# Altium project UKU205V3.PRJPCB
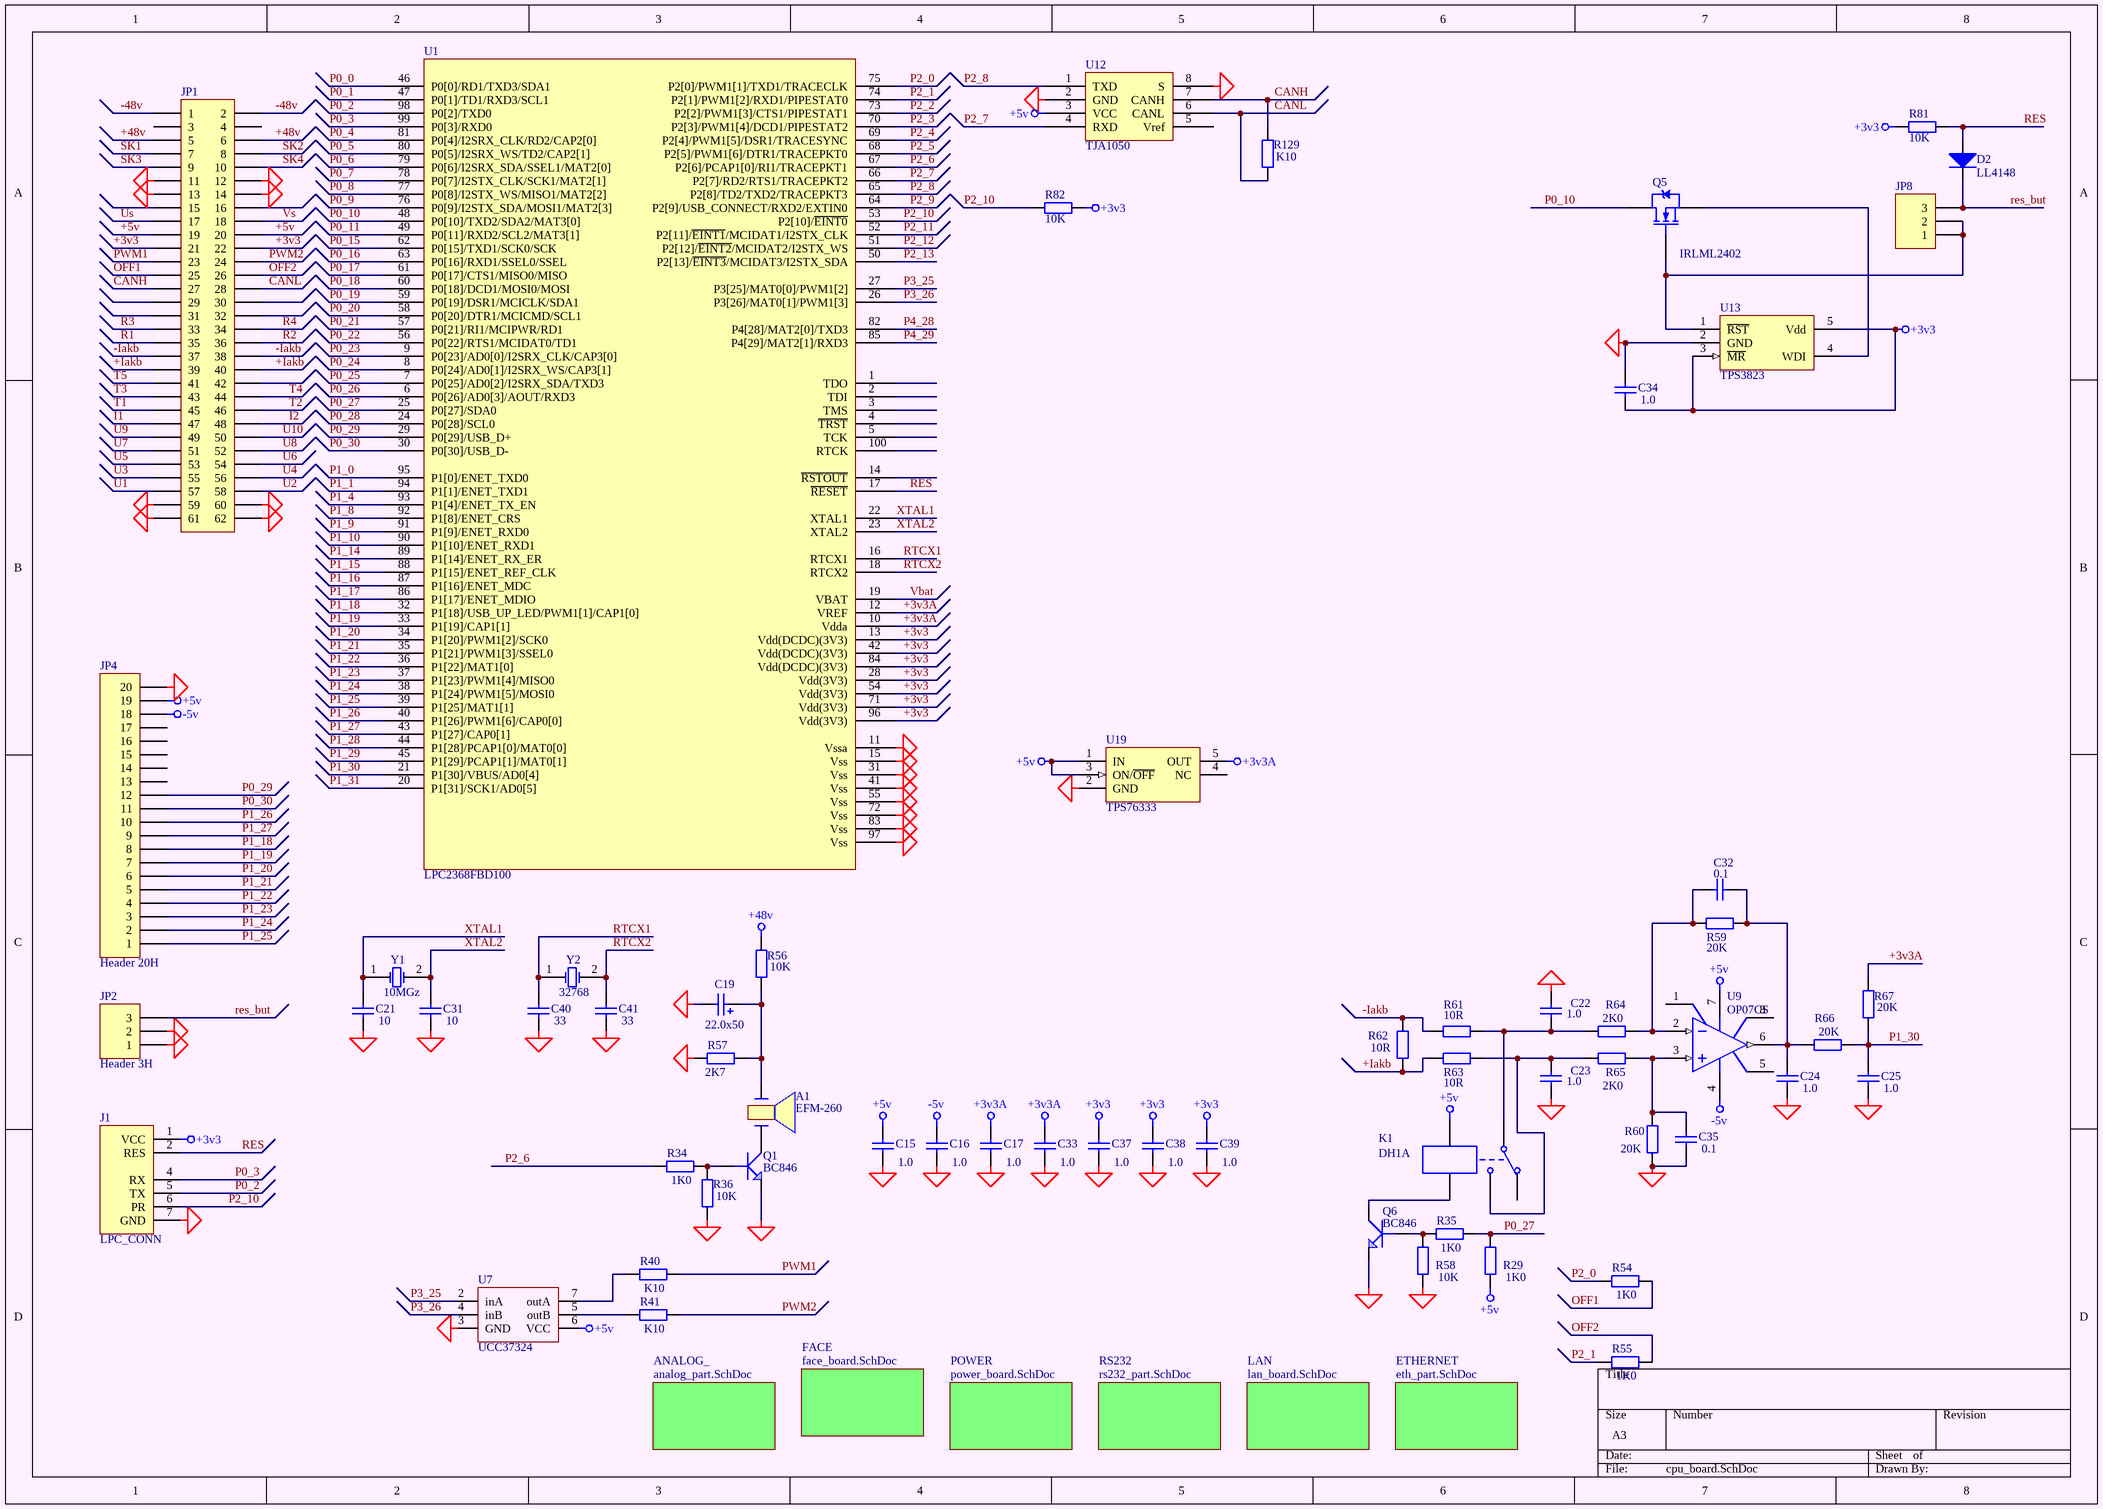
[diagram p0: cpu_board.SchDoc]
5 sheets, 258 parts. Net scope: flat (ports and power ports of the same name join across sheets).
Board file: UKU205V3.PcbDoc
Sheets:
  cpu_board.SchDoc
    POWER = power_board.SchDoc
    RS232 = rs232_part.SchDoc
    FACE = face_board.SchDoc
    ANALOG_ = analog_part.SchDoc

## Sheet cpu_board.SchDoc
size A3

### Parts
A1  EFM-260  [Pjezo15]
C15  1.0  [C3216-1206]
C16  1.0  [C3216-1206]
C17  1.0  [_1206]
C19  22.0x50  [el3]
C21  10  [_1206]
C22  1.0  [_1206]
C23  1.0  [_1206]
C24  1.0  [_1206]
C25  1.0  [_1206]
C31  10  [_1206]
C32  0.1  [_1206]
C33  1.0  [_1206]
C34  1.0  [_1206]
C35  0.1  [_1206]
C37  1.0  [_1206]
C38  1.0  [_1206]
C39  1.0  [_1206]
C40  33  [_1206]
C41  33  [_1206]
D2  LL4148  [_1206d]
J1  LPC_CONN  [HDR1X7]
JP1  (no value)  [HDR2X30]
JP2  Header 3H  [HDR1X3H]
JP4  Header 20H  [HDR1X20H]
JP8  PLS-3  [HDR1X3]  (value not drawn)
K1  DH1A  [kuan]
Q1  BC846  [SO-G3]
Q5  IRLML2402  [SO-G3]
Q6  BC846  [SO-G3]
R29  1K0  [_1206]
R34  1K0  [_1206]
R35  1K0  [_1206]
R36  10K  [_1206]
R40  K10  [_1206]
R41  K10  [_1206]
R54  1K0  [_1206]
R55  1K0  [_1206]
R56  10K  [_1206]
R57  2K7  [_1206]
R58  10K  [_1206]
R59  20K  [_1206]
R60  20K  [_1206]
R61  10R  [_1206]
R62  10R  [_1206]
R63  10R  [_1206]
R64  2K0  [_1206]
R65  2K0  [_1206]
R66  20K  [_1206]
R67  20K  [_1206]
R81  10K  [_1206]
R82  10K  [_1206]
R129  K10  [_1206]
U1  LPC2368FBD100  [LPC2368]
U7  UCC37324  [SO-G8]
U9  OP07CS  [SO-G8]
U12  TJA1050  [SO-G8]
U13  TPS3823  [SO-G5/P.95]
U19  TPS76333  [SO-G5/P.95]
Y1  10MGz  [QWARZ1]
Y2  32768  [QWARZ2]

### Sub-sheets
ANALOG_ = analog_part.SchDoc: no entries
ETHERNET = eth_part.SchDoc (file not in this document): no entries
FACE = face_board.SchDoc: no entries
LAN = lan_board.SchDoc (file not in this document): no entries
POWER = power_board.SchDoc: no entries
RS232 = rs232_part.SchDoc: no entries

### Nets
+3v3: C34.1 C37.2 C38.2 C39.2 J1.1(VCC) JP1.21 JP1.22 R81.2 R82.1 U1.13(Vdd(DCDC)(3V3)) U1.28(Vdd(3V3)) U1.42(Vdd(DCDC)(3V3)) U1.54(Vdd(3V3)) U1.71(Vdd(3V3)) U1.84(Vdd(DCDC)(3V3)) U1.96(Vdd(3V3)) U13.3(~{MR}) U13.5(Vdd)
+3v3A: C17.2 C33.2 R67.2 U1.10(Vdda) U1.12(VREF) U19.5(OUT)
+5v: C15.2 JP1.19 JP1.20 JP4.19 K1.4 R29.1 U7.6(VCC) U9.7(V+) U12.3(VCC) U19.1(IN) U19.3(ON/~{OFF})
+48v: JP1.5 JP1.6 R56.2
-5v: C16.2 JP4.18 U9.4(V-)
GND: C15.1 C16.1 C17.1 C19.2 C21.1 C22.1 C23.2 C24.1 C25.1 C31.1 C33.1 C34.2 C35.2 C37.1 C38.1 C39.1 C40.1 C41.1 J1.7(GND) JP1.11 JP1.12 JP1.13 JP1.14 JP1.59 JP1.60 JP1.61 JP1.62 JP2.1 JP2.2 JP4.20 Q1.2(E) Q6.2(E) R36.1 R57.1 R58.1 R60.1 U1.11(Vssa) U1.15(Vss) U1.31(Vss) U1.41(Vss) U1.55(Vss) U1.72(Vss) U1.83(Vss) U1.97(Vss) U7.3(GND) U12.2(GND) U12.8(S) U13.2(GND) U19.2(GND)
+Iakb: JP1.39 JP1.40 R62.1 R63.2
-48v: JP1.1 JP1.2
-Iakb: JP1.37 JP1.38 R61.2 R62.2
CANH: JP1.27 R129.2 U12.7(CANH)
CANL: JP1.28 R129.1 U12.6(CANL)
I1: JP1.47
I2: JP1.48
OFF1: JP1.25 R54.2
OFF2: JP1.26 R55.2
P0_0: U1.46(P0[0]/RD1/TXD3/SDA1)
P0_1: U1.47(P0[1]/TD1/RXD3/SCL1)
P0_2: J1.5(TX) U1.98(P0[2]/TXD0)
P0_3: J1.4(RX) U1.99(P0[3]/RXD0)
P0_4: U1.81(P0[4]/I2SRX_CLK/RD2/CAP2[0])
P0_5: U1.80(P0[5]/I2SRX_WS/TD2/CAP2[1])
P0_6: U1.79(P0[6]/I2SRX_SDA/SSEL1/MAT2[0])
P0_7: U1.78(P0[7]/I2STX_CLK/SCK1/MAT2[1])
P0_8: U1.77(P0[8]/I2STX_WS/MISO1/MAT2[2])
P0_9: U1.76(P0[9]/I2STX_SDA/MOSI1/MAT2[3])
P0_10: Q5.3(D) U1.48(P0[10]/TXD2/SDA2/MAT3[0])
P0_11: U1.49(P0[11]/RXD2/SCL2/MAT3[1])
P0_15: U1.62(P0[15]/TXD1/SCK0/SCK)
P0_16: U1.63(P0[16]/RXD1/SSEL0/SSEL)
P0_17: U1.61(P0[17]/CTS1/MISO0/MISO)
P0_18: U1.60(P0[18]/DCD1/MOSI0/MOSI)
P0_19: U1.59(P0[19]/DSR1/MCICLK/SDA1)
P0_20: U1.58(P0[20]/DTR1/MCICMD/SCL1)
P0_21: U1.57(P0[21]/RI1/MCIPWR/RD1)
P0_22: U1.56(P0[22]/RTS1/MCIDAT0/TD1)
P0_23: U1.9(P0[23]/AD0[0]/I2SRX_CLK/CAP3[0])
P0_24: U1.8(P0[24]/AD0[1]/I2SRX_WS/CAP3[1])
P0_25: U1.7(P0[25]/AD0[2]/I2SRX_SDA/TXD3)
P0_26: U1.6(P0[26]/AD0[3]/AOUT/RXD3)
P0_27: R29.2 R35.1 U1.25(P0[27]/SDA0)
P0_28: U1.24(P0[28]/SCL0)
P0_29: JP4.12 U1.29(P0[29]/USB_D+)
P0_30: JP4.11 U1.30(P0[30]/USB_D-)
P1_0: U1.95(P1[0]/ENET_TXD0)
P1_1: U1.94(P1[1]/ENET_TXD1)
P1_4: U1.93(P1[4]/ENET_TX_EN)
P1_8: U1.92(P1[8]/ENET_CRS)
P1_9: U1.91(P1[9]/ENET_RXD0)
P1_10: U1.90(P1[10]/ENET_RXD1)
P1_14: U1.89(P1[14]/ENET_RX_ER)
P1_15: U1.88(P1[15]/ENET_REF_CLK)
P1_16: U1.87(P1[16]/ENET_MDC)
P1_17: U1.86(P1[17]/ENET_MDIO)
P1_18: JP4.8 U1.32(P1[18]/USB_UP_LED/PWM1[1]/CAP1[0])
P1_19: JP4.7 U1.33(P1[19]/CAP1[1])
P1_20: JP4.6 U1.34(P1[20]/PWM1[2]/SCK0)
P1_21: JP4.5 U1.35(P1[21]/PWM1[3]/SSEL0)
P1_22: JP4.4 U1.36(P1[22]/MAT1[0])
P1_23: JP4.3 U1.37(P1[23]/PWM1[4]/MISO0)
P1_24: JP4.2 U1.38(P1[24]/PWM1[5]/MOSI0)
P1_25: JP4.1 U1.39(P1[25]/MAT1[1])
P1_26: JP4.10 U1.40(P1[26]/PWM1[6]/CAP0[0])
P1_27: JP4.9 U1.43(P1[27]/CAP0[1])
P1_28: U1.44(P1[28]/PCAP1[0]/MAT0[0])
P1_29: U1.45(P1[29]/PCAP1[1]/MAT0[1])
P1_30: C25.2 R66.2 R67.1 U1.21(P1[30]/VBUS/AD0[4])
P1_31: U1.20(P1[31]/SCK1/AD0[5])
P2_0: R54.1 U1.75(P2[0]/PWM1[1]/TXD1/TRACECLK)
P2_1: R55.1 U1.74(P2[1]/PWM1[2]/RXD1/PIPESTAT0)
P2_2: U1.73(P2[2]/PWM1[3]/CTS1/PIPESTAT1)
P2_3: U1.70(P2[3]/PWM1[4]/DCD1/PIPESTAT2)
P2_4: U1.69(P2[4]/PWM1[5]/DSR1/TRACESYNC)
P2_5: U1.68(P2[5]/PWM1[6]/DTR1/TRACEPKT0)
P2_6: R34.1 U1.67(P2[6]/PCAP1[0]/RI1/TRACEPKT1)
P2_7: U1.66(P2[7]/RD2/RTS1/TRACEPKT2) U12.4(RXD)
P2_8: U1.65(P2[8]/TD2/TXD2/TRACEPKT3) U12.1(TXD)
P2_9: U1.64(P2[9]/USB_CONNECT/RXD2/EXTIN0)
P2_10: J1.6(PR) R82.2 U1.53(P2[10]/~{EINT0})
P2_11: U1.52(P2[11]/~{EINT1}/MCIDAT1/I2STX_CLK)
P2_12: U1.51(P2[12]/~{EINT2}/MCIDAT2/I2STX_WS)
P2_13: U1.50(P2[13]/~{EINT3}/MCIDAT3/I2STX_SDA)
P3_25: U1.27(P3[25]/MAT0[0]/PWM1[2]) U7.2(inA)
P3_26: U1.26(P3[26]/MAT0[1]/PWM1[3]) U7.4(inB)
P4_28: U1.82(P4[28]/MAT2[0]/TXD3)
P4_29: U1.85(P4[29]/MAT2[1]/RXD3)
PWM1: JP1.23 R40.1
PWM2: JP1.24 R41.1
R1: JP1.35
R2: JP1.36
R3: JP1.33
R4: JP1.34
RES: D2.1(A) J1.2(RES) R81.1 U1.17(~{RESET})
res_but: D2.2(K) JP2.3 JP8.3
RTCX1: C40.2 U1.16(RTCX1) Y2.1(OSC1)
RTCX2: C41.2 U1.18(RTCX2) Y2.2(OSC2)
SK1: JP1.7
SK2: JP1.8
SK3: JP1.9
SK4: JP1.10
T1: JP1.45
T2: JP1.46
T3: JP1.43
T4: JP1.44
T5: JP1.41
U1: JP1.57
U2: JP1.58
U3: JP1.55
U4: JP1.56
U5: JP1.53
U6: JP1.54
U7: JP1.51
U8: JP1.52
U9: JP1.49
U10: JP1.50
Us: JP1.17
Vbat: U1.19(VBAT)
Vs: JP1.18
XTAL1: C21.2 U1.22(XTAL1) Y1.1(OSC1)
XTAL2: C31.2 U1.23(XTAL2) Y1.2(OSC2)
NetA1_1: A1.1 Q1.3(C)
NetA1_2: A1.2 C19.1 R56.1 R57.2
NetC22_2: C22.2 K1.1 R61.1 R64.1
NetC23_1: C23.1 K1.3 R63.1 R65.1
NetC24_2: C24.2 C32.2 R59.1 R66.1 U9.6(OUT)
NetC32_1: C32.1 R59.2 R64.2 U9.2(IN-)
NetC35_1: C35.1 R60.2 R65.2 U9.3(IN+)
NetJP8_1: JP8.1 JP8.2 Q5.1(G) U13.1(~{RST})
NetK1_5: K1.5 Q6.3(C)
NetQ1_1: Q1.1(B) R34.2 R36.2
NetQ5_2: Q5.2(S) U13.4(WDI)
NetQ6_1: Q6.1(B) R35.2 R58.2
NetR40_2: R40.2 U7.7(outA)
NetR41_2: R41.2 U7.5(outB)

Not connected (* = marked no-connect by the designer): JP1 3 4 15 16 29 30 31 32 42; JP4 13 14 15 16 17; K1 2; U1 1(TDO) 2(TDI) 3(TMS) 4(~{TRST}) 5(TCK) 14(~{RSTOUT}) 100(RTCK); U9 1(VOSTRIM) 5(NC) 8(VOSTRIM); U12 5(Vref); U19 4(NC)

### Library data of the parts
A1 = PJEZ0
C15-C17 C32 C33 C35 C37-C39 = Cap Semi: Capacitor (Semiconductor SIM Model); Manufacturer: Generic Components; Class I: Passive; Value: 0,1; Published: 8-Jun-2000; Revision: July-2002: Re-released for DXP Platform.; Publisher: Altium Limited; Class II: Capacitor
C19 = Cap Pol1: Polarized Capacitor (Radial); Manufacturer: Generic Components; Class I: Passive; Value: 22,0; Published: 8-Jun-2000; Revision: July-2002: Re-released for DXP Platform.; Publisher: Altium Limited; Class II: Capacitor
C21 C31 C40 C41 = Cap Semi: Capacitor (Semiconductor SIM Model); Manufacturer: Generic Components; Class I: Passive; Value: 15pF; Published: 8-Jun-2000; Revision: July-2002: Re-released for DXP Platform.; Publisher: Altium Limited; Class II: Capacitor
C22-C25 = Cap Semi: Capacitor (Semiconductor SIM Model); Manufacturer: Generic Components; Class I: Passive; Value: 1,0; Published: 8-Jun-2000; Revision: July-2002: Re-released for DXP Platform.; Publisher: Altium Limited; Class II: Capacitor
C34 = Cap Semi: Capacitor; Manufacturer: Generic Components; Class I: Passive; Value: 0,1; Published: 8-Jun-2000; Revision: July-2002: Re-released for DXP Platform.; Publisher: Altium Limited; Class II: Capacitor
D2 = Diode: Default Diode; Manufacturer: Generic Components; Class I: Discrete; Class II: Diode - Switching; Published: 8-Jun-2000; Revision: July-2002: Re-released for DXP Platform.; Publisher: Altium Limited
JP1 = Header 31X2: Header, 30-Pin, Dual row; Manufacturer: Generic Components; Class I: Connector; Revision: July-2002: Re-released for DXP Platform.; Publisher: Altium Limited
JP2 = Header 3H: Header, 3-Pin,  Right Angle; Manufacturer: Generic Components; Class I: Connector; Revision: July-2002: Re-released for DXP Platform.; Publisher: Altium Limited
JP4 = Header 20H: Header, 20-Pin,  Right Angle; Manufacturer: Generic Components; Class I: Connector; Revision: July-2002: Re-released for DXP Platform.; Publisher: Altium Limited
JP8 = Header 3: Header, 3-Pin; Manufacturer: Generic Components; Class I: Connector; Revision: July-2002: Re-released for DXP Platform.; Publisher: Altium Limited
K1 = BS115: Single-Pole Dual-Throw Relay; Manufacturer: Generic Components; Class I: Electro-mechanical; Published: 24-Mar-1999; Revision: July-2002: Re-released for DXP Platform.; Publisher: Altium Limited; Class II: Relay
Q1 Q6 = GT122: Right: 20; Bottom: 20
Q5 = IRLML2402: HEXFET Power MOSFET; Manufacturer: International Rectifier; Class I: Discrete; Class II: MOSFET - Power; Published: 8-Jun-2000; Revision: July-2002: Re-released for DXP Platform.; Datasheet: Latest Revision: Aug-1997; Package Reference: SOT-23; Publisher: Altium Limited; Value: IRLML2402
R29 = Res2: Resistor; Manufacturer: Generic Components; Class I: Passive; Value: 10K; Published: 8-Jun-2000; Revision: July-2002: Re-released for DXP Platform.; Publisher: Altium Limited; Class II: Resistor
R34 R35 R40 R41 R54-R57 R61-R63 R81 R82 = Res2: Resistor; Manufacturer: Generic Components; Class I: Passive; Rule: Undefined; Published: 8-Jun-2000; Revision: July-2002: Re-released for DXP Platform.; Publisher: Altium Limited; Class II: Resistor
  R34 R35 R54 R55: Value: 1K0
  R40 R41: Value: K10
  R56 R81 R82: Value: 10K
  R57: Value: 2K7
  R61-R63: Value: 10R
R36 R58-R60 R64-R67 = Res2: Resistor; Manufacturer: Generic Components; Class I: Passive; Published: 8-Jun-2000; Revision: July-2002: Re-released for DXP Platform.; Publisher: Altium Limited; Class II: Resistor
  R36 R58: Value: 10K
  R59 R60 R66 R67: Value: 20K
  R64 R65: Value: 2K0
R129 = Res2: Resistor; Manufacturer: Generic Components; Class I: Passive; Value: 120; Published: 8-Jun-2000; Revision: July-2002: Re-released for DXP Platform.; Publisher: Altium Limited; Class II: Resistor
U9 = OP07CS: Ultra-Low Offset Voltage Operational Amplifier; Manufacturer: Analog Devices; Note: Pin 5 is not connected.; Published: 8-Jun-2000; Revision: July-2002: Re-released for DXP Platform.; Datasheet: Designer's Reference Manual CD (1992); Package Reference: SO-8B; Publisher: Altium Limited; Class I: Amplifier; Class II: Operational Amplifier
U13 = TPS3823: Reset IC; Manufacturer: National Semiconductor; Package Information: Latest Revision: Aug-1999; Class I: Power Management; Class II: Voltage Regulator; Value: TPS76333; Published: 15-Apr-2002; Datasheet: Latest Revision: Oct-1999; Package Reference: MA05B; Publisher: Altium Limited
U19 = LP2980AIM5-3.3: Micropower SOT, 50 mA Ultra Low-Dropout Regulator; Manufacturer: National Semiconductor; Package Information: Latest Revision: Aug-1999; Class I: Power Management; Class II: Voltage Regulator; Published: 15-Apr-2002; Datasheet: Latest Revision: Oct-1999; Package Reference: MA05B; Publisher: Altium Limited
Y1 Y2 = XTAL: Crystal Oscillator; Manufacturer: Generic Components; Published: 8-Jun-2000; Revision: July-2002: Re-released for DXP Platform.; Publisher: Altium Limited; Class I: Oscillator; Class II: Crystal Oscillator

## Sheet power_board.SchDoc
size A3
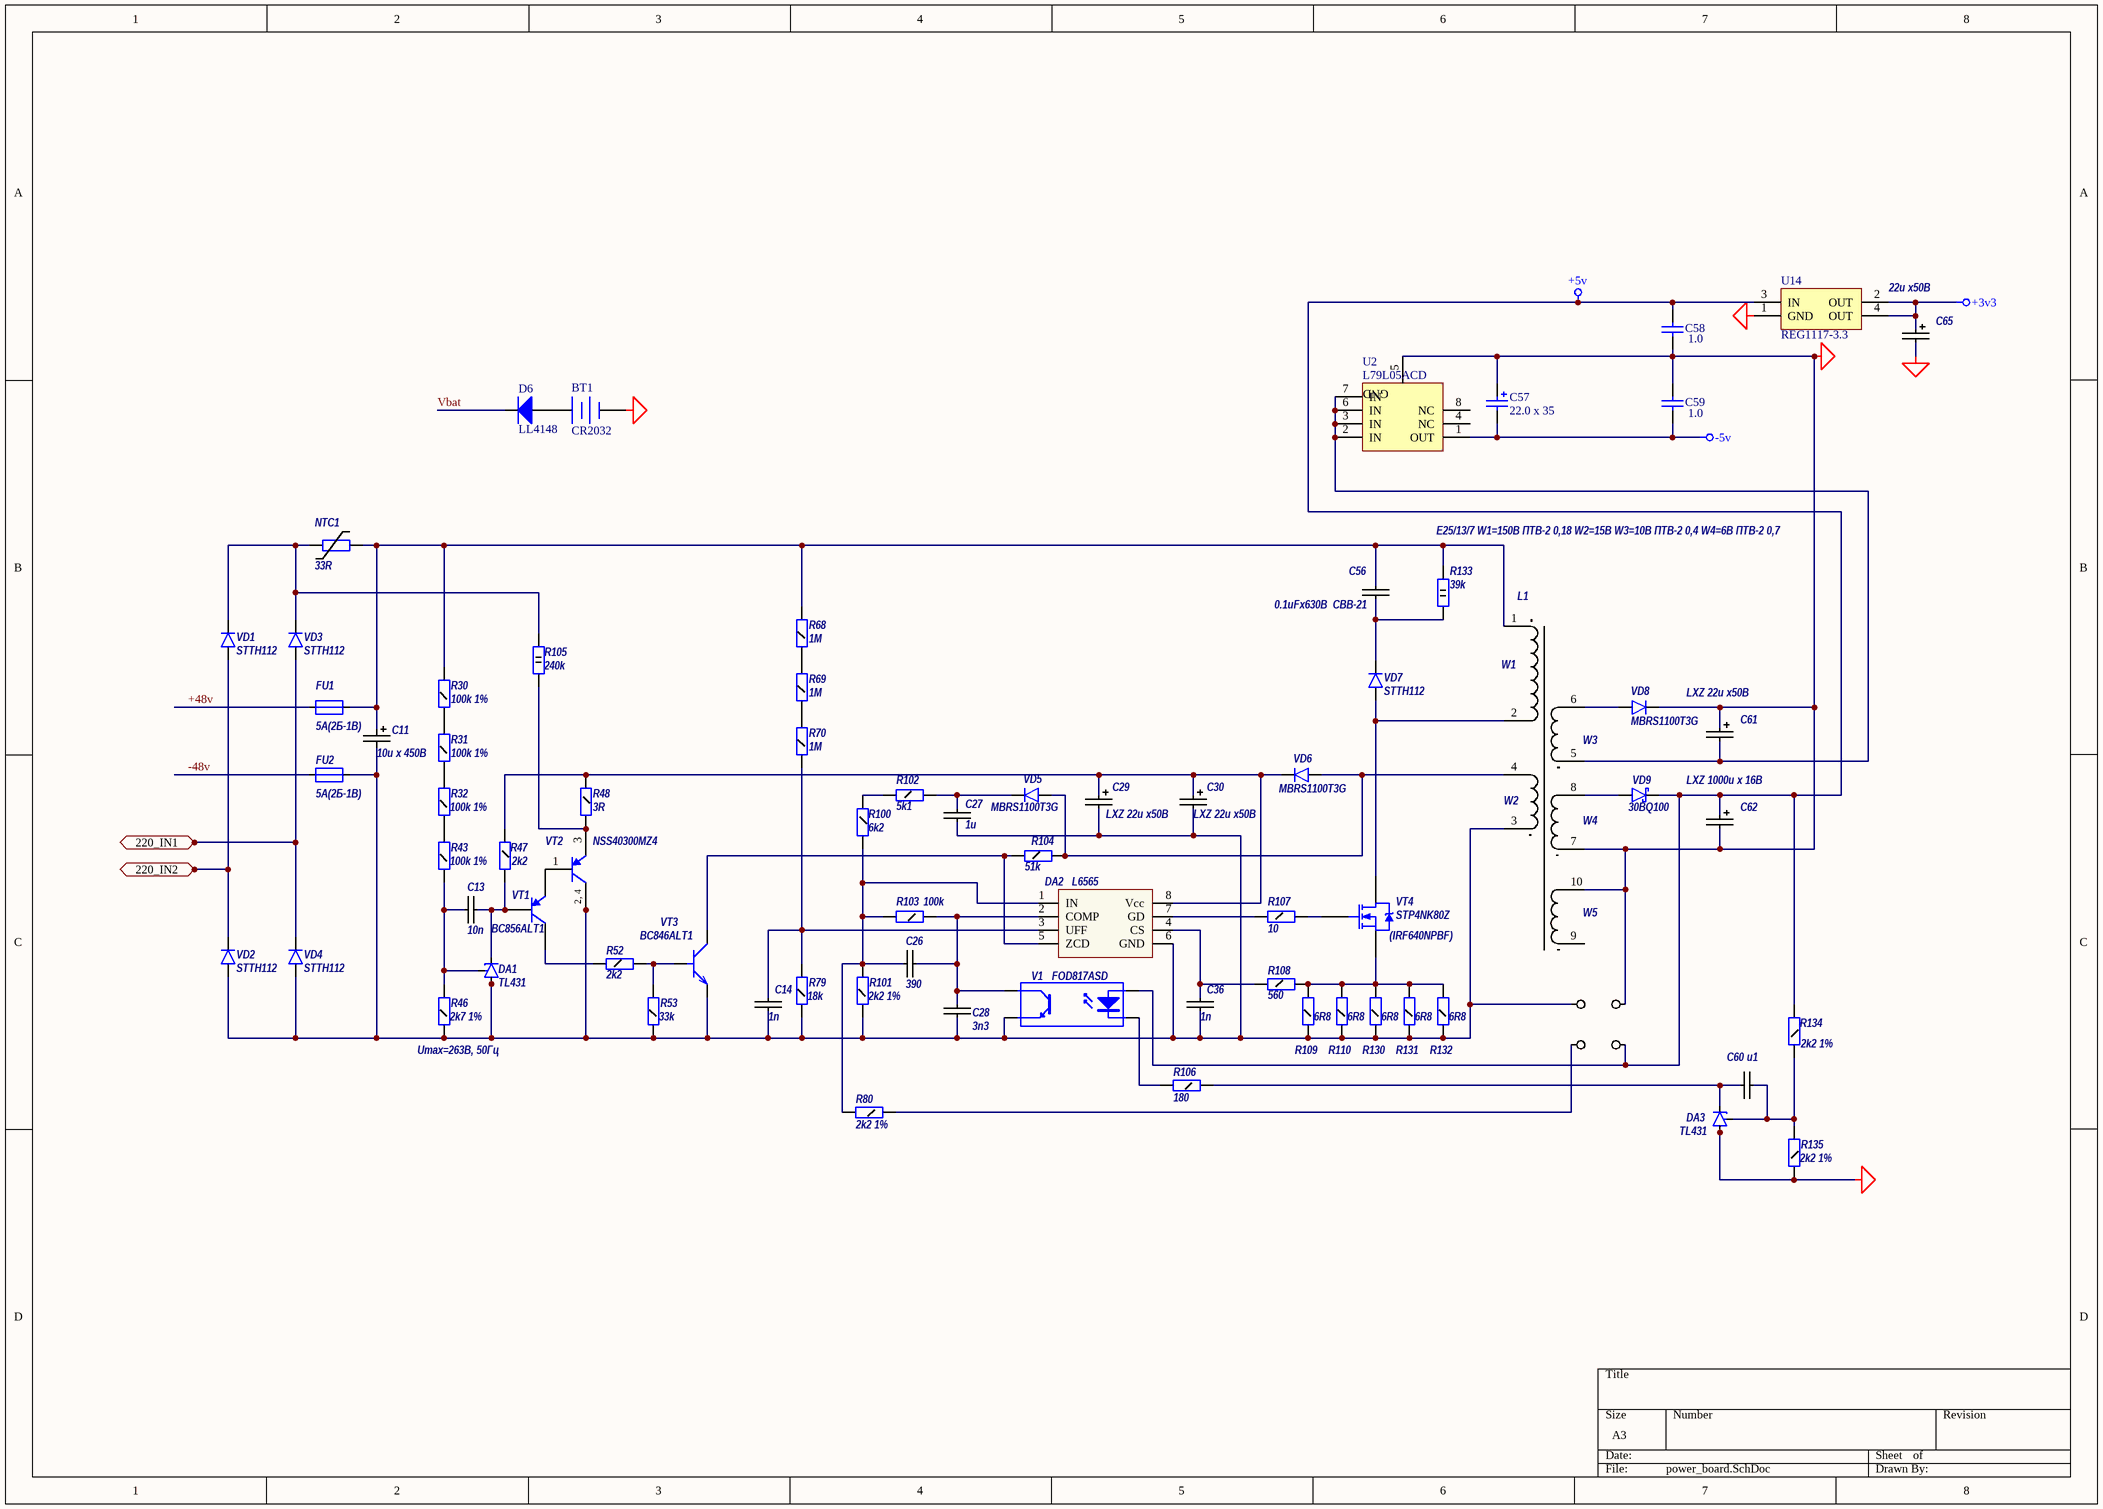
[diagram p1: power_board.SchDoc]

### Parts
BT1  CR2032  [BAT_SUPP]
C11  10u x 450B  [10uf x 450V]
C13  10n  [_1206]
C14  1n  [_1206]
C26  390  [_1206]
C27  1u  [_1206]
C28  3n3  [_1206]
C29  LXZ 22u x50B  [CAP_POL_6.3x12]
C30  LXZ 22u x50B  [CAP_POL_6.3x12]
C36  1n  [_1206]
C56  0.1uFx630B  CBB-21  [0.1uf *630V]
C57  22.0 x 35  [el3]
C58  1.0  [C3216-1206]
C59  1.0  [C3216-1206]
C60  u1  [_1206]
C61  LXZ 22u x50B  [CAP_POL_6.3x12]
C62  LXZ 1000u x 16B  [CAP_POL_13x21]
C65  22u x50B  [CAP_POL_6.3x12]
D6  LL4148  [_1206d]
DA1  TL431  [SO-G8]
DA2  L6565  [SO-G8]
DA3  TL431  [SO-G8]
FU1  5A(2Б-1В)  [FUSE-3A]
FU2  5A(2Б-1В)  [FUSE-3A]
L1  E25/13/7 W1=150B ПТВ-2 0,18 W2=15B W3=10B ПТВ-2 0,4 W4=6B ПТВ-2 0,7  [Lps_360RH]
NTC1  33R  [NTC 33R]
R30  100k 1%  [_1206]
R31  100k 1%  [_1206]
R32  100k 1%  [_1206]
R43  100k 1%  [_1206]
R46  2k7 1%  [_1206]
R47  2k2  [_1206]
R48  3R  [_1206]
R52  2k2  [_1206]
R53  33k  [_1206]
R68  1M  [_1206]
R69  1M  [_1206]
R70  1M  [_1206]
R79  18k  [_1206]
R80  2k2 1%  [_1206]
R100  6k2  [_1206]
R101  2k2 1%  [_1206]
R102  5k1  [_1206]
R103  100k  [_1206]
R104  51k  [_1206]
R105  240k  [MF-2 vert]
R106  180  [_1206]
R107  10  [_1206]
R108  560  [_1206]
R109  6R8  [_1206]
R110  6R8  [_1206]
R130  6R8  [_1206]
R131  6R8  [_1206]
R132  6R8  [_1206]
R133  39k  [MF-2 vert]
R134  2k2 1%  [_1206]
R135  2k2 1%  [_1206]
U2  L79L05ACD  [SO-G8]
U14  REG1117-3.3  [SIP-G3/C7.4]
V1  FOD817ASD  [FOD817ASD]
VD1  STTH112  [10bq*]
VD2  STTH112  [10bq*]
VD3  STTH112  [10bq*]
VD4  STTH112  [10bq*]
VD5  MBRS1100T3G  [10bq*]
VD6  MBRS1100T3G  [10bq*]
VD7  STTH112  [10bq*]
VD8  MBRS1100T3G  [10bq*]
VD9  30BQ100  [30bq*]
VT1  BC856ALT1  [318-08]
VT2  NSS40300MZ4  [SOT223_N]
VT3  BC846ALT1  [SOT-23]
VT4  STP4NK80Z  [TO-220AB]
XP1  PAD  [PAD_otv]  (value not drawn)
XP2  PAD  [PAD_otv]  (value not drawn)
XP3  PAD  [PAD_otv]  (value not drawn)
XP4  PAD  [PAD_otv]  (value not drawn)
XP5  PAD  [PAD_otv]  (value not drawn)
XP6  PAD  [PAD_otv]  (value not drawn)

### Ports
220_IN1, 220_IN2

### Nets
+3v3: C65.+ U14.2(OUT) U14.4(OUT)
+5v: C58.2 C62.+ R134.2 U14.3(IN) V1.1(A) VD9.2 XP6.1
-5v: C57.2 C59.1 U2.1(OUT)
GND: BT1.2(-) C57.1 C58.1 C59.2 C61.+ C62.- C65.- DA3.6 DA3.7 L1.7 L1.10 R135.1 U2.5(GND) U14.1(GND) VD8.2 XP5.1
+48v: FU1.1
-48v: FU2.1
Vbat: D6.2(K)
NetBT1_1: BT1.1(+) D6.1(A)
NetC11_1: C11.1 C56.1(OA) FU1.2 L1.1 NTC1.2 R30.2 R68.2 R133.2
NetC11_2: C11.2 C14.2(OA) C27.2(OA) C28.1(OA) C29.- C30.- C36.2(OA) DA1.6 DA1.7 DA2.6(GND) FU2.2 L1.3 R46.1 R53.1 R79.1 R101.1 R109.1 R110.1 R130.1 R131.1 R132.1 V1.3(E) VD2.1 VD4.1 VT2.2(C) VT2.4(C) VT3.2 XP3.1
NetC13_1: C13.1(OA) DA1.8 R43.1 R46.2
NetC13_2: C13.2(OA) DA1.1 R47.2 VT1.1(B)
NetC14_1: C14.1(OA) DA2.3(UFF) R70.1 R79.2
NetC26_1: C26.1(OA) DA2.1(IN) R80.2 R100.2 R101.2 R103.2
NetC26_2: C26.2(OA) C28.2(OA) DA2.2(COMP) R103.1 V1.4(C)
NetC27_1: C27.1(OA) R102.2 VD5.2
NetC29_+: C29.+ C30.+ DA2.8(Vcc) R47.1 R48.1 VD6.2
NetC36_1: C36.1(OA) DA2.4(CS) R108.1
NetC56_2: C56.2(OA) R133.1 VD7.2
NetC60_1: C60.1(OA) DA3.1 R106.1
NetC60_2: C60.2(OA) DA3.8 R134.1 R135.2
NetC61_-: C61.- L1.5 U2.2(IN) U2.3(IN) U2.6(IN) U2.7(IN)
NetDA2_5: DA2.5(ZCD) R104.1 VT3.3
NetDA2_7: DA2.7(GD) R107.1
NetL1_2: L1.2 VD7.1 VT4.2(D)
NetL1_4: L1.4 R104.2 VD5.1 VD6.1
NetL1_6: L1.6 VD8.1
NetL1_8: L1.8 VD9.1
NetNTC1_1: NTC1.1 R105.1 VD1.2 VD3.2
NetR30_1: R30.1 R31.2
NetR31_1: R31.1 R32.2
NetR32_1: R32.1 R43.2
NetR48_2: R48.2 R105.2 VT2.3(E)
NetR52_1: R52.1 VT1.3(C)
NetR52_2: R52.2 R53.2 VT3.1
NetR68_1: R68.1 R69.2
NetR69_1: R69.1 R70.2
NetR80_1: R80.1 XP4.1
NetR100_1: R100.1 R102.1
NetR106_2: R106.2 V1.2(K)
NetR107_2: R107.2 VT4.1(G)
NetR108_2: R108.2 R109.2 R110.2 R130.2 R131.2 R132.2 VT4.3(S)
NetVD1_1: VD1.1 VD2.2 XP2.1 ; port 220_IN2
NetVD3_1: VD3.1 VD4.2 XP1.1 ; port 220_IN1
NetVT1_2: VT1.2(E) VT2.1(B)

Not connected (* = marked no-connect by the designer): L1 9; U2 4(NC) 8(NC)

### Notes on the sheet
- (near VT4) (IRF640NPBF)
- (near R46) Umax=263B, 50Гц
- (in symbol BSP32) 2, 4
- (in symbol Lps_360RH) W1; W3; W2; W4; W5

### Library data of the parts
BT1 = Battery: Multicell Battery; Manufacturer: Generic Components; Published: 24-Mar-1999; Revision: July-2002: Re-released for DXP Platform.; Publisher: Altium Limited
C11 = 10мкФ х 450В: Power: 450В; Value: 10u x 450B; Feature: Конденсатор
C13 = Capacitor: ManufacturerPartNumber: CC1206 1мкФ±10% 50В X7R; SType: -X7R-50В; Tolerance: 10%; Body: 1206; Docum: PHYCOMP; Type1: C1206; Value: 10n; Feature: Конденсатор; Package: 1206
C14 C26-C28 C36 C60 = Capacitor: Type1: C1206; Tolerance: 10%; SType: -X7R-50B; Docum: PHYCOMP; Pins: 2; Feature: Конденсатор; Package: 1206
  C14 C36: Value: 1n
  C26: Value: 390
  C27: Value: 1u
  C28: Value: 3n3
  C60: Value: u1
C29 C30 C61 = CAP_POL: ManufacturerPartNumber: 22мкФ±20% 50В KMF; SType: -50В; Docum: Nippon Chemi-Con; Type1: EKY; Tolerance: 20%; Value: LXZ 22u x50B; Feature: Конденсатор
C56 = Capacitor: ManufacturerPartNumber: 0.1мкФ±20% 250В; SType: -250В; Docum: ОЖО.461.104 ТУ; Type1: К73-17; Tolerance: 20%; Value: 0.1uFx630B  CBB-21; Feature: Конденсатор
C57 = Cap Pol1: Polarized Capacitor (Radial); Manufacturer: Generic Components; Class I: Passive; Value: 10,0x25; Published: 8-Jun-2000; Revision: July-2002: Re-released for DXP Platform.; Publisher: Altium Limited; Class II: Capacitor
C58 C59 = Cap Semi: as C15 on sheet cpu_board; Published: 8-Jun-2000; Revision: July-2002: Re-released for DXP Platform.; Publisher: Altium Limited; Class II: Capacitor
C62 = 1000 мкФ х 25В: Tolerance: -20 +80%; Type1: Nippon Chemi-Con; SType: -LXY-25B; Value: 1000u; Feature: Конденсатор; Dopvalue: 1000 мкФ х 25В
C65 = CAP_POL: ManufacturerPartNumber: 22мкФ±20% 50В KMF; Value: LXZ 22u x50B; SType: -50В; Docum: Nippon Chemi-Con; Type1: EKY; Tolerance: 20%; Feature: Конденсатор
D6 = Diode: as D2 on sheet cpu_board; Published: 8-Jun-2000; Revision: July-2002: Re-released for DXP Platform.; Publisher: Altium Limited
DA1 = TL431: Docum: Texas Instruments; Body: SO-8; Feature: Микросхема; Type1: TL431; ManufacturerPartNumber: TL431; Package: SO-8
DA2 = L6565: Docum: ST Microelectronics; Feature: Микросхема
DA3 = TL431: Docum: Texas Instruments; Feature: Микросхема
FU1 FU2 = FUSE: VValue: 5A; Feature: Предохранитель; Value: 5A
L1 = Lps_360RH: Индуктивность
NTC1 = NTC 33R: Позистор; Feature: Позистор
R30 R31 R68 R69 R104 R107-R110 R130-R132 = R1206: Tolerance: 5%; Docum: Bourns; Feature: Резистор; Type1: R1206
  R30 R31: Value: 100k 1%
  R68 R69: Value: 1M
  R104: Value: 51k
  R107: Value: 10
  R108: Value: 560
  R109 R110 R130-R132: Value: 6R8
R32 R43 R80 R101 R134 R135 = R1206: Docum: Bourns; Feature: Резистор; Tolerance: 1%; Type1: R1206
  R32 R43: Value: 100k 1%
  R80 R101 R135: Value: 2k2 1%
  R134: Value: 2k2
R46 = R1206: Value: 1k6; Docum: Bourns; Feature: Резистор; Tolerance: 1%; Type1: R1206
R47 R48 R52 R53 R70 R79 R100 R102 R103 R106 = R1206: Tolerance: 1%; Docum: Bourns; Feature: Резистор; Type1: R1206
  R47 R52: Value: 2k2
  R48: Value: 3R
  R53: Value: 33k
  R70: Value: 1M
  R79: Value: 18k
  R100: Value: 6k2
  R102: Value: 5k1
  R103: Value: 100k
  R106: Value: 180
R105 = Res 2W: Power/Voltage: 2; Tolerance: 10%; Docum: Hitano; Type1: MF-2; Value: 240k; Feature: Резистор; VValue: 240k
R133 = Res 2W: Value: 100k
U2 = L79L05ACD: Negative Voltage Regulator; Manufacturer: ST-Microelectronics; Package Information: Latest Revision: Jul-1998; Class I: Power Management; Published: 24-Aug-2001; Revision: July-2002: Re-released for DXP Platform.; Datasheet: Latest Revision: Apr-1999; Package Reference: SO8; Publisher: Altium Limited; Class II: Voltage Regulator
U14 = REG1117-3.3: 800mA and 1A Low Dropout Positive Regulator 2.85V, 3.3V, 5V, and Adjustable; Manufacturer: Burr-Brown; Package Information: Latest Revision: Rev. C; Class I: Power Management; Class II: Voltage Regulator; Published: 8-Jun-2000; Revision: July-2002: Re-released for DXP Platform.; Datasheet: Latest Revision: Sep-1997; Package Reference: ZZ311; Publisher: Altium Limited
V1 = FOD817ASD: Docum: Fairchild Semiconductor; Feature: Оптопара; Type1: FOD817ASD
VD1-VD4 VD7 = DIOD_2: ManufacturerPartNumber: STTH2R060U; Docum: ST Microelectronics; Body: SMB; Feature: Диод; Type1: STTH112; Package: SMB
VD5 VD6 VD8 = DIOD_1: Docum: ON Semiconductor; Feature: Диод; Type1: MBRS1100T3G
VD9 = DIOD_SH: Docum: International Rectifier; Body: SMC; Feature: Диод; Type1: 30BQ100; ManufacturerPartNumber: 30BQ100; Package: SMC
VT1 = BC856ALT1: General Purpose Transistor PNP Silicon; Manufacturer: ON Semiconductor; Body: SOT-23; Published: 29-Sep-2000; LatestRevisionDate: 17-Jul-2002; LatestRevisionNote: Re-released for DXP Platform.; DatasheetVersion: 1997; PackageVersion: 1997; PackageReference: 318-08; Publisher: Altium Limited; PackageDescription: SOT-23; 3 Leads; Body 3.0 x 2.6 mm, inc. leads (LxW max); ComponentLink1Description: Manufacturer Link; ComponentLink1URL: http://www.onsemi.com/site/products/landing?taxonomyID=194; ComponentLink2Description: Datasheet; ComponentLink2URL: http://www.onsemi.com/pub/Collateral/BC856ALT1-D.PDF; Value: BC856ALT1; Feature: Транзистор; Manufacturer Number: BC856ALT1
VT2 = BSP32: Транзистор; Производитель: ON Semiconductor; Published: 17-Sep-2003; LatestRevisionDate: 12-Dec-2006; LatestRevisionNote: IPC-7351 Footprint Added.; DatasheetVersion: 26-Apr-1999; PackageVersion: Aug-2001; PackageReference: SOT223; Publisher: Altium Limited; PackageDescription: 4-Pin SOT-223 Package 2.3 mm Pitch, 7 mm Lead Span; ComponentLink1URL: http://www.semiconductors.philips.com/; ComponentLink2Description: Datasheet; ComponentLink2URL: http://www.semiconductors.philips.com/acrobat/datasheets/BSP31_32_33_3.pdf; Feature: Транзистор; Type1: NSS40300MZ4
VT3 = TRANS_npn: Docum: ON Semiconductor; Feature: Транзистор; Type1: BC846ALT1; Body: SOT-23; ManufacturerPartNumber: BC846ALT1; Package: SOT-23
VT4 = NMOS-2: N-Channel Power MOSFET; Note: Pin 2 is electrically connected to pin 4.; Published: 8-Jun-2000; LatestRevisionDate: 17-Jul-2002; LatestRevisionNote: Re-released for DXP Platform.; DatasheetVersion: PD-9.814; PackageVersion: Feb-1997; PackageReference: TO-220AB; Publisher: Altium Limited; PackageDescription: TO, Thru-Hole, Vertical, Heatsink Mounted; 3 In-Line Leads; Pitch 2.54 mm; ComponentLink1Description: Manufacturer Link; ComponentLink1URL: http://www.irf.com/

## Sheet rs232_part.SchDoc
size B
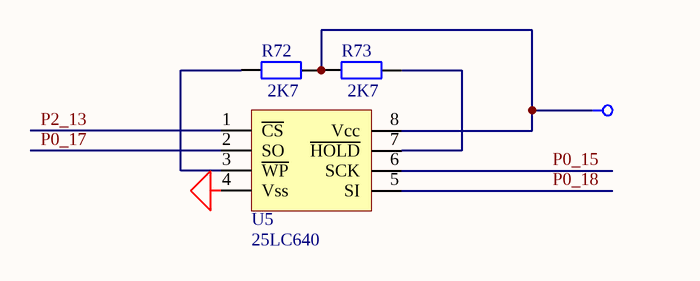
[diagram p2: rs232_part.SchDoc]

### Parts
R72  2K7  [_1206]
R73  2K7  [_1206]
U5  25LC640  [SO-G8/D5]

### Nets
+5v: R72.2 R73.1 U5.8(Vcc)
GND: U5.4(Vss)
P0_15: U5.6(SCK)
P0_17: U5.2(SO)
P0_18: U5.5(SI)
P2_13: U5.1(~{CS})
NetR72_1: R72.1 U5.3(~{WP})
NetR73_2: R73.2 U5.7(~{HOLD})

### Library data of the parts
R72 R73 = Res2: as R34 on sheet cpu_board; Published: 8-Jun-2000; Revision: July-2002: Re-released for DXP Platform.; Publisher: Altium Limited; Class II: Resistor; Value: 2K7

## Sheet face_board.SchDoc
size A3
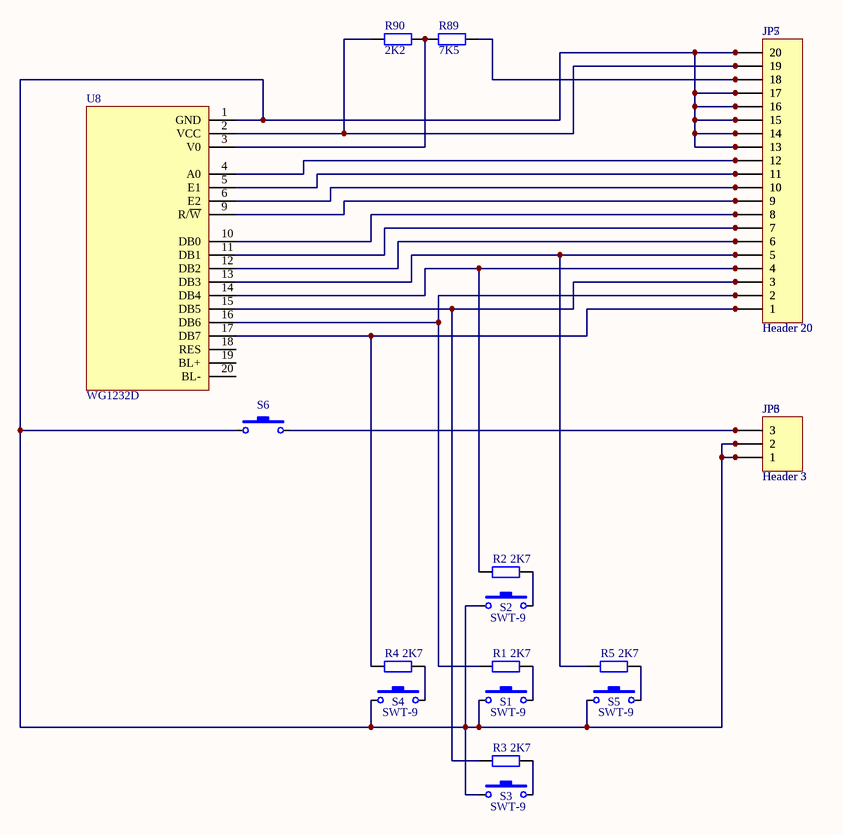
[diagram p3: face_board.SchDoc]

### Parts
JP3  Header 3  [HDR1X3]
JP5  Header 20  [HDR1X20]
JP6  Header 3  [HDR1X3]
JP7  Header 20  [HDR1X20]
R1  2K7  [_1206]
R2  2K7  [_1206]
R3  2K7  [_1206]
R4  2K7  [_1206]
R5  2K7  [_1206]
R89  7K5  [_1206]
R90  2K2  [_1206]
S1  SWT-9  [SWT-9]
S2  SWT-9  [SWT-9]
S3  SWT-9  [SWT-9]
S4  SWT-9  [SWT-9]
S5  SWT-9  [SWT-9]
S6  SWT-6  [SWT-6]  (value not drawn)
U8  WG1232D  [WG1232D]

### Nets
NetJP3_1: JP3.1 JP3.2 JP5.13 JP5.14 JP5.15 JP5.16 JP5.17 JP5.20 JP6.1 JP6.2 JP7.13 JP7.14 JP7.15 JP7.16 JP7.17 JP7.20 S1.1 S2.1 S3.1 S4.1 S5.1 S6.1 U8.1(GND)
NetJP3_3: JP3.3 JP6.3 S6.2
NetJP5_1: JP5.1 JP7.1 R4.2 U8.17(DB7)
NetJP5_2: JP5.2 JP7.2 R1.2 U8.16(DB6)
NetJP5_3: JP5.3 JP7.3 R3.2 U8.15(DB5)
NetJP5_4: JP5.4 JP7.4 R2.2 U8.14(DB4)
NetJP5_5: JP5.5 JP7.5 R5.2 U8.13(DB3)
NetJP5_6: JP5.6 JP7.6 U8.12(DB2)
NetJP5_7: JP5.7 JP7.7 U8.11(DB1)
NetJP5_8: JP5.8 JP7.8 U8.10(DB0)
NetJP5_9: JP5.9 JP7.9 U8.9(R/~{W})
NetJP5_10: JP5.10 JP7.10 U8.6(E2)
NetJP5_11: JP5.11 JP7.11 U8.5(E1)
NetJP5_12: JP5.12 JP7.12 U8.4(A0)
NetJP5_18: JP5.18 JP7.18 R89.1
NetJP5_19: JP5.19 JP7.19 R90.2 U8.2(VCC)
NetR1_1: R1.1 S1.2
NetR2_1: R2.1 S2.2
NetR3_1: R3.1 S3.2
NetR4_1: R4.1 S4.2
NetR5_1: R5.1 S5.2
NetR89_2: R89.2 R90.1 U8.3(V0)

Not connected (* = marked no-connect by the designer): U8 18(RES) 19(BL+) 20(BL-)

### Library data of the parts
JP3 JP6 = Header 3: as JP8 on sheet cpu_board; Revision: July-2002: Re-released for DXP Platform.; Publisher: Altium Limited
JP5 JP7 = Header 20: Header, 20-Pin; Manufacturer: Generic Components; Class I: Connector; Revision: July-2002: Re-released for DXP Platform.; Publisher: Altium Limited
R1-R5 R89 R90 = Res2: as R34 on sheet cpu_board; Published: 8-Jun-2000; Revision: July-2002: Re-released for DXP Platform.; Publisher: Altium Limited; Class II: Resistor
  R1-R5: Value: 2K7
  R89: Value: 7K5
  R90: Value: 2K2
S1-S5 = SWT-9: Switch; Manufacturer: Generic Components; Published: 24-Mar-1999; Revision: July-2002: Re-released for DXP Platform.; Publisher: Altium Limited
S6 = SWT-9: Button; Manufacturer: Generic Components; Published: 24-Mar-1999; Revision: July-2002: Re-released for DXP Platform.; Publisher: Altium Limited; Value: SWT-6
U8 = WG1232D_pereh

## Sheet analog_part.SchDoc
size A3
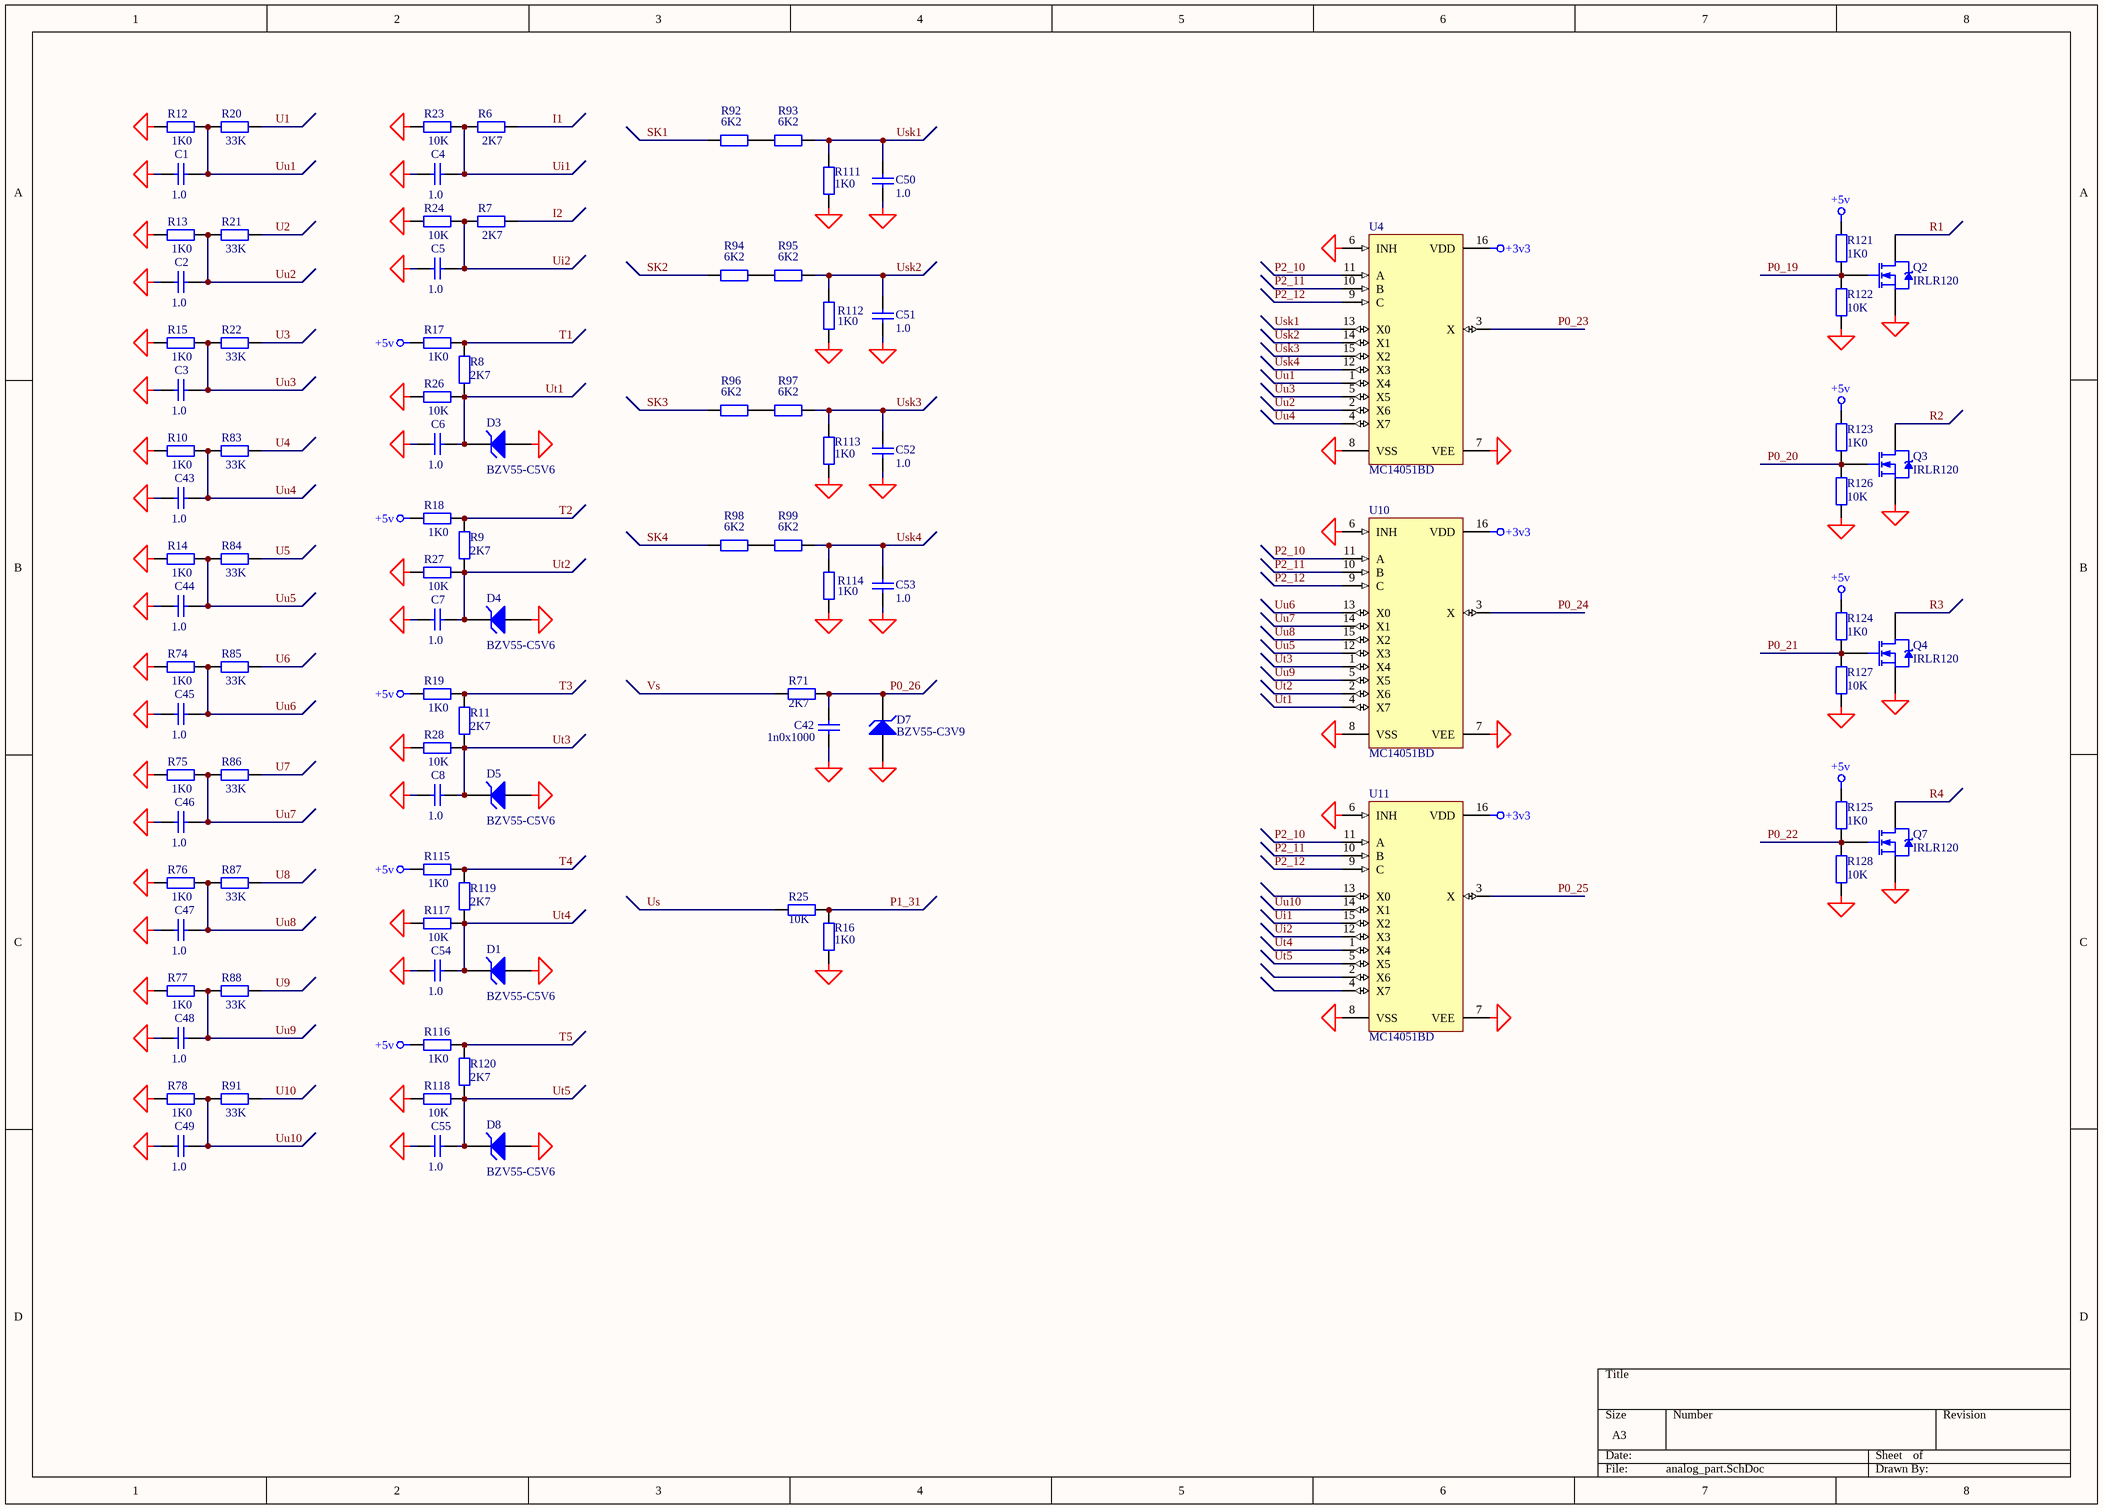
[diagram p4: analog_part.SchDoc]

### Parts
C1  1.0  [_1206]
C2  1.0  [_1206]
C3  1.0  [_1206]
C4  1.0  [_1206]
C5  1.0  [_1206]
C6  1.0  [_1206]
C7  1.0  [_1206]
C8  1.0  [_1206]
C42  1n0x1000  [_1206]
C43  1.0  [_1206]
C44  1.0  [_1206]
C45  1.0  [_1206]
C46  1.0  [_1206]
C47  1.0  [_1206]
C48  1.0  [_1206]
C49  1.0  [_1206]
C50  1.0  [_1206]
C51  1.0  [_1206]
C52  1.0  [_1206]
C53  1.0  [_1206]
C54  1.0  [_1206]
C55  1.0  [_1206]
D1  BZV55-C5V6  [_1206d]
D3  BZV55-C5V6  [_1206d]
D4  BZV55-C5V6  [_1206d]
D5  BZV55-C5V6  [_1206d]
D7  BZV55-C3V9  [_1206d]
D8  BZV55-C5V6  [_1206d]
Q2  IRLR120  [SIP-G3/E8]
Q3  IRLR120  [SIP-G3/E8]
Q4  IRLR120  [SIP-G3/E8]
Q7  IRLR120  [SIP-G3/E8]
R6  2K7  [_1206]
R7  2K7  [_1206]
R8  2K7  [_1206]
R9  2K7  [_1206]
R10  1K0  [_1206]
R11  2K7  [_1206]
R12  1K0  [_1206]
R13  1K0  [_1206]
R14  1K0  [_1206]
R15  1K0  [_1206]
R16  1K0  [_1206]
R17  1K0  [_1206]
R18  1K0  [_1206]
R19  1K0  [_1206]
R20  33K  [_1206]
R21  33K  [_1206]
R22  33K  [_1206]
R23  10K  [_1206]
R24  10K  [_1206]
R25  10K  [_1206]
R26  10K  [_1206]
R27  10K  [_1206]
R28  10K  [_1206]
R71  2K7  [_1206]
R74  1K0  [_1206]
R75  1K0  [_1206]
R76  1K0  [_1206]
R77  1K0  [_1206]
R78  1K0  [_1206]
R83  33K  [_1206]
R84  33K  [_1206]
R85  33K  [_1206]
R86  33K  [_1206]
R87  33K  [_1206]
R88  33K  [_1206]
R91  33K  [_1206]
R92  6K2  [_1206]
R93  6K2  [_1206]
R94  6K2  [_1206]
R95  6K2  [_1206]
R96  6K2  [_1206]
R97  6K2  [_1206]
R98  6K2  [_1206]
R99  6K2  [_1206]
R111  1K0  [_1206]
R112  1K0  [_1206]
R113  1K0  [_1206]
R114  1K0  [_1206]
R115  1K0  [_1206]
R116  1K0  [_1206]
R117  10K  [_1206]
R118  10K  [_1206]
R119  2K7  [_1206]
R120  2K7  [_1206]
R121  1K0  [_1206]
R122  10K  [_1206]
R123  1K0  [_1206]
R124  1K0  [_1206]
R125  1K0  [_1206]
R126  10K  [_1206]
R127  10K  [_1206]
R128  10K  [_1206]
U4  MC14051BD  [SO-G16/C5.85]
U10  MC14051BD  [SO-G16/C5.85]
U11  MC14051BD  [SO-G16/C5.85]

### Nets
+3v3: U4.16(VDD) U10.16(VDD) U11.16(VDD)
+5v: R17.2 R18.2 R19.2 R115.2 R116.2 R121.2 R123.2 R124.2 R125.2
GND: C1.2 C2.2 C3.2 C4.2 C5.2 C6.2 C7.2 C8.2 C42.2 C43.2 C44.2 C45.2 C46.2 C47.2 C48.2 C49.2 C50.2 C51.2 C52.2 C53.2 C54.2 C55.2 D1.1(A) D3.1(A) D4.1(A) D5.1(A) D7.1(A) D8.1(A) Q2.3(S) Q3.3(S) Q4.3(S) Q7.3(S) R10.2 R12.2 R13.2 R14.2 R15.2 R16.2 R23.1 R24.1 R26.1 R27.1 R28.1 R74.2 R75.2 R76.2 R77.2 R78.2 R111.1 R112.1 R113.1 R114.1 R117.1 R118.1 R122.2 R126.2 R127.2 R128.2 U4.6(INH) U4.7(VEE) U4.8(VSS) U10.6(INH) U10.7(VEE) U10.8(VSS) U11.6(INH) U11.7(VEE) U11.8(VSS)
I1: R6.2
I2: R7.2
P0_19: Q2.1(G) R121.1 R122.1
P0_20: Q3.1(G) R123.1 R126.1
P0_21: Q4.1(G) R124.1 R127.1
P0_22: Q7.1(G) R125.1 R128.1
P0_23: U4.3(X)
P0_24: U10.3(X)
P0_25: U11.3(X)
P0_26: C42.1 D7.2(K) R71.1
P1_31: R16.1 R25.1
P2_10: U4.11(A) U10.11(A) U11.11(A)
P2_11: U4.10(B) U10.10(B) U11.10(B)
P2_12: U4.9(C) U10.9(C) U11.9(C)
R1: Q2.4(D)
R2: Q3.4(D)
R3: Q4.4(D)
R4: Q7.4(D)
SK1: R92.1
SK2: R94.1
SK3: R96.1
SK4: R98.1
T1: R8.2 R17.1
T2: R9.2 R18.1
T3: R11.2 R19.1
T4: R115.1 R119.2
T5: R116.1 R120.2
U1: R20.2
U2: R21.2
U3: R22.2
U4: R83.2
U5: R84.2
U6: R85.2
U7: R86.2
U8: R87.2
U9: R88.2
U10: R91.2
Ui1: C4.1 R6.1 R23.2 U11.15(X2)
Ui2: C5.1 R7.1 R24.2 U11.12(X3)
Us: R25.2
Usk1: C50.1 R93.2 R111.2 U4.13(X0)
Usk2: C51.1 R95.2 R112.2 U4.14(X1)
Usk3: C52.1 R97.2 R113.2 U4.15(X2)
Usk4: C53.1 R99.2 R114.2 U4.12(X3)
Ut1: C6.1 D3.2(K) R8.1 R26.2 U10.4(X7)
Ut2: C7.1 D4.2(K) R9.1 R27.2 U10.2(X6)
Ut3: C8.1 D5.2(K) R11.1 R28.2 U10.1(X4)
Ut4: C54.1 D1.2(K) R117.2 R119.1 U11.1(X4)
Ut5: C55.1 D8.2(K) R118.2 R120.1 U11.5(X5)
Uu1: C1.1 R12.1 R20.1 U4.1(X4)
Uu2: C2.1 R13.1 R21.1 U4.2(X6)
Uu3: C3.1 R15.1 R22.1 U4.5(X5)
Uu4: C43.1 R10.1 R83.1 U4.4(X7)
Uu5: C44.1 R14.1 R84.1 U10.12(X3)
Uu6: C45.1 R74.1 R85.1 U10.13(X0)
Uu7: C46.1 R75.1 R86.1 U10.14(X1)
Uu8: C47.1 R76.1 R87.1 U10.15(X2)
Uu9: C48.1 R77.1 R88.1 U10.5(X5)
Uu10: C49.1 R78.1 R91.1 U11.14(X1)
Vs: R71.2
NetR92_2: R92.2 R93.1
NetR94_2: R94.2 R95.1
NetR96_2: R96.2 R97.1
NetR98_2: R98.2 R99.1

Not connected (* = marked no-connect by the designer): U11 2(X6) 4(X7) 13(X0)

### Library data of the parts
C1-C8 C42-C55 = Cap Semi: as C22 on sheet cpu_board; Published: 8-Jun-2000; Revision: July-2002: Re-released for DXP Platform.; Publisher: Altium Limited; Class II: Capacitor
D1 D3-D5 D7 D8 = D Zener: Zener Diode; Manufacturer: Generic Components; Class I: Discrete; Class II: Diode - Zener; Published: 8-Jun-2000; Revision: July-2002: Re-released for DXP Platform.; Publisher: Altium Limited
Q2-Q4 Q7 = IRFR120: HEXFET N-Channel Power MOSFET; Manufacturer: International Rectifier; Revision 1: 10-July-2000: SIM Model Added.; Revision 2: July-2002: Re-released for DXP Platform.; Class I: Discrete; Class II: MOSFET - Power; Note: Pin 2 is trimmed and is electrically connected to Drain.; Published: 8-Jun-2000; Datasheet: Latest Revision: PD-9.523D; Package Reference: TO-252AA; Publisher: Altium Limited
R6-R9 R11 R20-R28 R71 R83-R88 R91-R99 R111-R114 R117-R120 = Res2: as R34 on sheet cpu_board; Published: 8-Jun-2000; Revision: July-2002: Re-released for DXP Platform.; Publisher: Altium Limited; Class II: Resistor
  R6-R9 R11 R71 R119 R120: Value: 2K7
  R20-R22 R83-R88 R91: Value: 33K
  R23-R28 R117 R118: Value: 10K
  R92-R99: Value: 6K2
  R111-R114: Value: 1K0
R10 R12-R19 R74-R78 R115 R116 = Res2: Resistor; Manufacturer: Generic Components; Class I: Passive; Value: 1K; Rule: Undefined; Published: 8-Jun-2000; Revision: July-2002: Re-released for DXP Platform.; Publisher: Altium Limited; Class II: Resistor
R121-R128 = Res2: Resistor; Manufacturer: Generic Components; Class I: Passive; Value: 1K; Published: 8-Jun-2000; Revision: July-2002: Re-released for DXP Platform.; Publisher: Altium Limited; Class II: Resistor
U4 U10 U11 = MC14051BD: 8-Channel Analog Multiplexer/Demultiplexer; Manufacturer: ON Semiconductor; Class I: Logic; Class II: Multiplexer/Encoder/Selector; Published: 15-Apr-2002; Package Reference: 751B-05; Publisher: Altium Limited

## Nets that join several sheets
+3v3: cpu_board (18 pins), power_board (C65.+ U14.2 U14.4), analog_part (U4.16 U10.16 U11.16)
+5v: cpu_board (11 pins), power_board (7 pins), rs232_part (R72.2 R73.1 U5.8), analog_part (9 pins)
-5v: cpu_board (C16.2 JP4.18 U9.4), power_board (C57.2 C59.1 U2.1)
GND: cpu_board (49 pins), power_board (16 pins), rs232_part (U5.4), analog_part (67 pins)